# Altium schematic sheet HeadSheet.SchDoc: Headsheet
size Letter; ApprovedBy: Kevin; Author: Jessica; Organization: Cegep Limoilou; Address1: 1300, 8e Avenue; Address2: Québec, QC; Address3: Canada; Address4: G1J 5L5; Revision: A; SheetNumber: 1; SheetTotal: 4
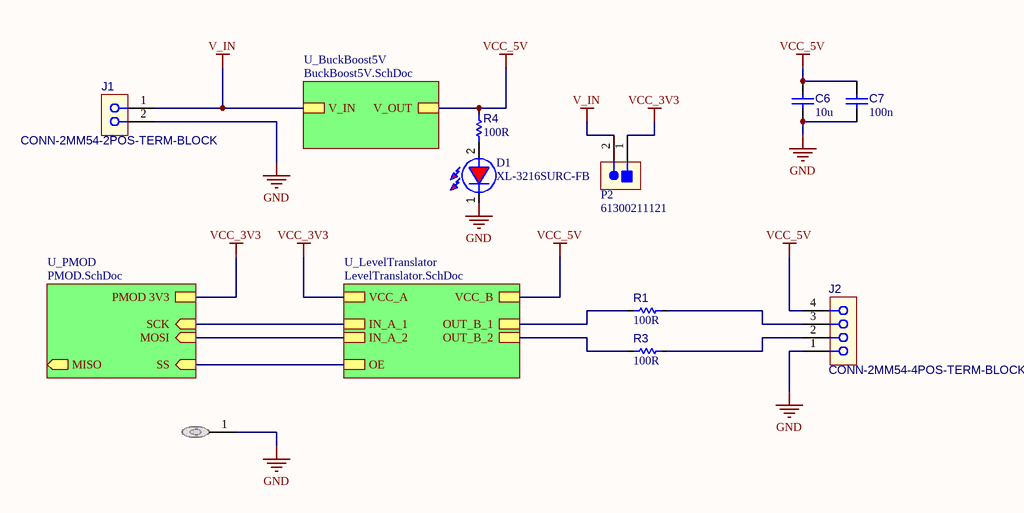
[diagram p0: HeadSheet.SchDoc]

## Parts
C6  value 10u  [C_2012[0805]]  (hidden comment: CAP CER 10uF 10V X7R 0805)
C7  value 100n  [C_1608[0603]]  (hidden comment: CAP CER 100nF 50V 0603)
D1  XL-3216SURC-FB  [LED 1206]
J1  CONN-2MM54-2POS-TERM-BLOCK  [CONN_TERM_BLOCK_2POS_100MIL]
J2  CONN-2MM54-4POS-TERM-BLOCK  [CONN_TERM_BLOCK_4POS_100MIL]
MH1  DNP  [MP_M-Hole_#4-40_LOOSE-FIT]  (value not drawn)  (no BOM)
P2  61300211121  [CONN_HDR_2POS_100MILS_TH]
R1  value 100R  [R_1608[0603]]  (hidden comment: Res 100R 1% 0603)
R3  value 100R  [R_1608[0603]]  (hidden comment: Res 100R 1% 0603)
R4  value 100R  [R_1608[0603]]  (hidden comment: Res 100R 1% 0603)

## Sub-sheets
U_BuckBoost5V = BuckBoost5V.SchDoc: V_IN, V_OUT
U_LevelTranslator = LevelTranslator.SchDoc: VCC_A, VCC_B, OUT_B_1, OUT_B_2, IN_A_1, IN_A_2, OE
U_PMOD = PMOD.SchDoc: PMOD 3V3, SCK (in), MOSI (in), SS (in), MISO (out)

## Nets
GND: C6.1 C7.1 D1.1(K) J1.2 J2.1 MH1.1
V_IN: J1.1 P2.2 ; sheet U_BuckBoost5V/V_IN
VCC_3V3: P2.1 ; sheet U_LevelTranslator/VCC_A, sheet U_PMOD/PMOD 3V3
VCC_5V: C6.2 C7.2 J2.4 R4.2 ; sheet U_BuckBoost5V/V_OUT, sheet U_LevelTranslator/VCC_B
NetD1_2: D1.2(A) R4.1
NetJ2_2: J2.2 R3.2
NetJ2_3: J2.3 R1.2
NetR1_1: R1.1 ; sheet U_LevelTranslator/OUT_B_1
NetR3_1: R3.1 ; sheet U_LevelTranslator/OUT_B_2
(unnamed): sheet U_LevelTranslator/IN_A_1, sheet U_PMOD/SCK
(unnamed): sheet U_LevelTranslator/IN_A_2, sheet U_PMOD/MOSI
(unnamed): sheet U_LevelTranslator/OE, sheet U_PMOD/SS

## Notes on the sheet
- Titre :
- Conception :
- Date :
- Approbation :
- Heure :
- Révision :
- Feuille
- de
- Fichier :

## Library data of the parts
C6 = CAP004: Capacitor type 1; Manufacturer 1: muRata; Manufacturer Part Number 1: GRM21BR71A106KE51L; LibRef: CAP004; Code CEGEP: KCOND03SM; Tolerance: 10%; Rated Voltage: 10V; Dielectric: X7R; Mounting Technology: SMT; Supplier 1: LCSC; Supplier Part Number 1: C86038
C7 = CAP002: Capacitor type 1; Manufacturer 1: Yageo; Manufacturer Part Number 1: CC0603KRX7R9BB104; LibRef: CAP002; Code CEGEP: COND0143SM; Tolerance: 10%; Dielectric: X7R; Rated Voltage: 50V; Mounting Technology: SMT; Supplier 1: LCSC; Supplier Part Number 1: C14663
D1 = D_LED_RED_1206: DEL Rouge 1206; Manufacturer 1: XINGLIGHT; Code CEGEP: LEDROUGECLAIR; Localisation: AVP-14; Manufacturer Part Number 1: XL-3216SURC-FB; Supplier 1: LCSC; Supplier Part Number 1: C3646938; Manufacturer 2: Würth Elektronik; Manufacturer Part Number 2: 150120RS75000; Supplier 2: Digikey; Supplier Part Number 2: 732-4991-1-ND; Mounting Technology: SMT
J1 = CONN-2MM54-2POS-TERM-BLOCK: CONN TERM BLOCK 2POS 100mil pitch; Manufacturer 1: Dorabo; Manufacturer Part Number 1: DB125-2.54-2P-GN-S; Supplier 1: LCSC; Supplier Part Number 1: C918120; Mounting Technology: TH; Manufacturer 2: Amphenol; Manufacturer Part Number 2: VN02A1500000G; Supplier 2: Digikey; Supplier Part Number 2: VN02A1500000G-ND
J2 = CONN-2MM54-4POS-TERM-BLOCK: CONN TERM BLOCK 4POS 100mil pitch; Manufacturer 1: Dorabo; Manufacturer Part Number 1: DB125-2.54-4P-GN-S; Supplier 1: LCSC; Supplier Part Number 1: C918122; Mounting Technology: TH; Manufacturer 2: Amphenol; Manufacturer Part Number 2: VN04A1500000G; Supplier 2: Digikey; Supplier Part Number 2: VN04A1500000G-ND
MH1 = MH-4-40: Mounting Hole #4-40 w/ Flat Washer; Manufacturer Part Number 1: DNP; Mounting Technology: N/A; Value: Mounting Hole #4-40 w/ Flat Washer; Supplier Part Number 1: N/A
P2 = CONN-100MIL-HDR-01X02: CONN HEADER 2POS 100MIL; Manufacturer 1: Megastar; Manufacturer Part Number 1: ZX-PZ2.54-1-2PZZ; Mounting Technology: TH; Supplier 1: LCSC; Supplier Part Number 1: C7501260; Manufacturer 2: Würth Elektronik; Manufacturer Part Number 2: 61300211121
R1 R3 R4 = RES029: Resistor type 1; Manufacturer 1: Yageo; Manufacturer Part Number 1: RC0603FR-07100RL; LibRef: RES029; Puissance: 1/10W; Max Working Voltage: 75V; Tolerance: 1%; Mounting Technology: SMT; Supplier 1: LCSC; Supplier Part Number 1: C105588